# EAGLE design lampe (EAGLE 6.4)
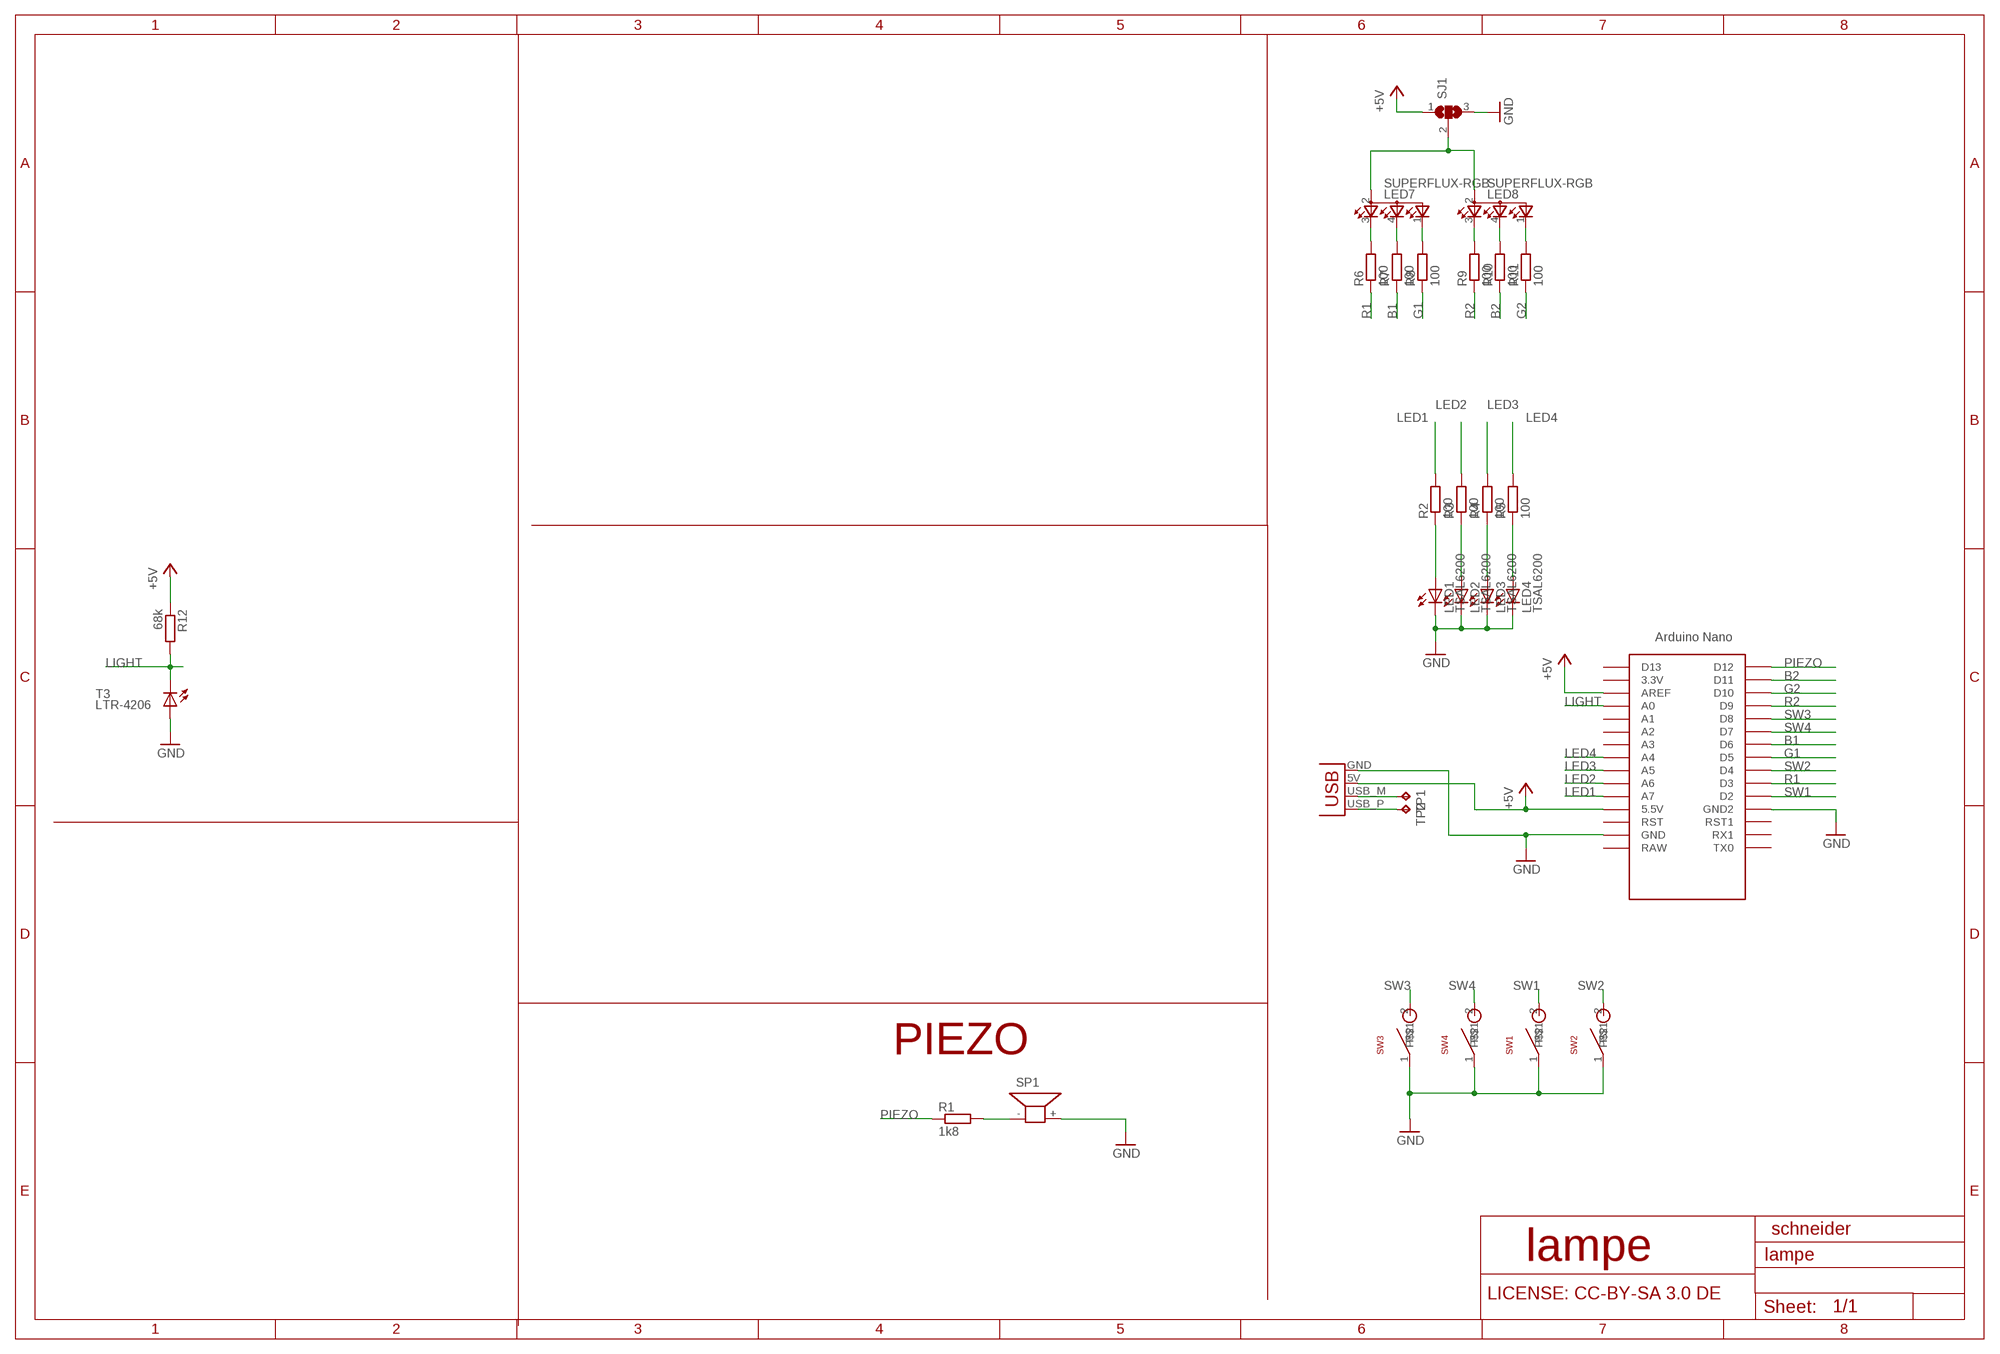
[diagram p0: schematic, sheet 1]

## Parts
LED1  TSAL6200  LED5MM  [LED5MM]
LED2  TSAL6200  LED5MM  [LED5MM]
LED3  TSAL6200  LED5MM  [LED5MM]
LED4  TSAL6200  LED5MM  [LED5MM]
LED7  SUPERFLUX-RGB  [SUPERFLUX-7.6X7.6]
LED8  SUPERFLUX-RGB  [SUPERFLUX-7.6X7.6]
R1  1k8  R-EU_0207/7  [0207/7]
R2  100  R-EU_0207/7  [0207/7]
R3  100  R-EU_0207/7  [0207/7]
R4  100  R-EU_0207/7  [0207/7]
R5  100  R-EU_0207/7  [0207/7]
R6  100  R-EU_0207/7  [0207/7]
R7  100  R-EU_0207/7  [0207/7]
R8  100  R-EU_0207/7  [0207/7]
R9  100  R-EU_0207/7  [0207/7]
R10  100  R-EU_0207/7  [0207/7]
R11  100  R-EU_0207/7  [0207/7]
R12  68k  R-EU_0207/7  [0207/7]
SJ1  SJ2W  [SJ_2]
SP1  AL11P  [AL11P]
SW1  SWITCH  [SWITCH]
SW2  SWITCH  [SWITCH]
SW3  SWITCH  [SWITCH]
SW4  SWITCH  [SWITCH]
T3  LTR-4206  LED3MM  [LED3MM]
TP1  TPB1,27  [B1,27]
TP2  TPB1,27  [B1,27]
U$1  NANO  [NANO]
X1  USBPCB  [USB-A-PCB]

## Nets
+5V: R12.1 SJ1.1 U$1.5V(5.5V) U$1.AREF X1.5V(VBUS)
B1: R7.1 U$1.D6
B2: R10.1 U$1.D11
G1: R8.1 U$1.D5
G2: R11.1 U$1.D10
GND: LED1.K(C) LED2.K(C) LED3.K(C) LED4.K(C) SJ1.3 SP1.+ SW1.1 SW2.1 SW3.1 SW4.1 T3.A U$1.GND U$1.GND1(GND2) X1.GND
LED1: R2.2 U$1.A7
LED2: R3.2 U$1.A6
LED3: R4.2 U$1.A5
LED4: R5.2 U$1.A4
LIGHT: R12.2 T3.K(C) U$1.A0
N$1: LED2.A R3.1
N$2: LED7.3(CRED) R6.2
N$3: LED3.A R4.1
N$4: LED7.4(CBLUE) R7.2
N$5: LED7.1(CGREEN) R8.2
N$6: LED8.3(CRED) R9.2
N$7: LED8.4(CBLUE) R10.2
N$8: LED8.1(CGREEN) R11.2
N$9: LED7.2(A2) LED8.2(A2) SJ1.2
N$10: LED4.A R5.1
N$11: TP1.TP X1.USB_M(D-)
N$12: TP2.TP X1.USB_P(D+)
N$17: LED1.A R2.1
N$29: R1.2 SP1.-
PIEZO: R1.1 U$1.D12
R1: R6.1 U$1.D3
R2: R9.1 U$1.D9
SW1: SW1.2 U$1.D2
SW2: SW2.2 U$1.D4
SW3: SW3.2 U$1.D8
SW4: SW4.2 U$1.D7
Unconnected: U$1.3.3V U$1.A1 U$1.A2 U$1.A3 U$1.D13 U$1.RAW U$1.RST U$1.RST1 U$1.RX1 U$1.TX0

## Notes on the sheet
- PIEZO
- schneider
- lampe
- LICENSE: CC-BY-SA 3.0 DE

## Library data of the parts
LED1-LED4 T3 = led:LED: LED OSRAM: - CHIPLED LG R971, LG N971, LY N971, LG Q971, LY Q971, LO R971, LY R971 LH N974, LH R974 LS Q976, LO Q976, LY Q976 LO Q996 - Hyper CHIPLED LW Q18S LB Q993, LB Q99A, LB R99A - SideLED LS A670, LO A670, LY A670, LG A670, LP A670 LB A673, LV A673, LT A673, LW A673 LH A674 LY A675 LS A676, LA A676, LO A676, LY A676, LW A676 LS A679, LY A679, LG A679 - Hyper Micro SIDELED® LS Y876, LA Y876, LO Y876, LY Y876 LT Y87S - SmartLED LW L88C, LW L88S LB L89C, LB L89S, LG L890 LS L89K, LO L89K, LY L89K LS L896, LA L896, LO L896, LY L896 - TOPLED LS T670, LO T670, LY T670, LG T670, LP T670 LSG T670, LSP T670, LSY T670, LOP T670, LYG T670 LG T671, LOG T671, LSG T671 LB T673, LV T673, LT T673, LW T673 LH T674 LS T676, LA T676, LO T676, LY T676, LB T676, LH T676, LSB T676, LW T676 LB T67C, LV T67C, LT T67C, LS T67K, LO T67K, LY T67K, LW E67C LS E67B, LA E67B, LO E67B, LY E67B, LB E67C, LV E67C, LT E67C LW T67C LS T679, LY T679, LG T679 LS T770, LO T770, LY T770, LG T770, LP T770 LB T773, LV T773, LT T773, LW T773 LH T774 LS E675, LA E675, LY E675, LS T675 LS T776, LA T776, LO T776, LY T776, LB T776 LHGB T686 LT T68C, LB T68C - Hyper Mini TOPLED® LB M676 - Mini TOPLED Santana® LG M470 LS M47K, LO M47K, LY M47K Source: http://www.osram.convergy.de LUXEON: - LUMILED® LXK2-PW12-R00, LXK2-PW12-S00, LXK2-PW14-U00, LXK2-PW14-V00 LXK2-PM12-R00, LXK2-PM12-S00, LXK2-PM14-U00 LXK2-PE12-Q00, LXK2-PE12-R00, LXK2-PE12-S00, LXK2-PE14-T00, LXK2-PE14-U00 LXK2-PB12-K00, LXK2-PB12-L00, LXK2-PB12-M00, LXK2-PB14-N00, LXK2-PB14-P00, LXK2-PB14-Q00 LXK2-PR12-L00, LXK2-PR12-M00, LXK2-PR14-Q00, LXK2-PR14-R00 LXK2-PD12-Q00, LXK2-PD12-R00, LXK2-PD12-S00 LXK2-PH12-R00, LXK2-PH12-S00 LXK2-PL12-P00, LXK2-PL12-Q00, LXK2-PL12-R00 Source: www.luxeon.com KINGBRIGHT: KA-3528ASYC Source: www.kingbright.com
LED7 LED8 = led:SUPERFLUX-RGB
R1-R12 = rcl:R-EU_: RESISTOR, European symbol
SJ1 = jumper:SJ2W: SMD solder JUMPER
SP1 = buzzer:AL11P: SPEAKER Source: Buerklin
SW1-SW4 = badge:SWITCH
TP1 TP2 = testpad:TP: Test pad
U$1 = Arduino-clone:NANO: Arduino Nano
X1 = SparkFun:USB: USB Connectors USB-B-PTH is fully proven SKU : PRT-00139 USB-miniB is fully proven SKU : PRT-00587 USB-A-PCB is untested. USB-A-H is throughly reviewed, but untested. Spark Fun Electronics SKU : PRT-00437 USB-B-SMT is throughly reviewed, but untested. Needs silkscreen touching up. USB-A-S has not been used/tested USB-MB-H has not been used/tested

## Board
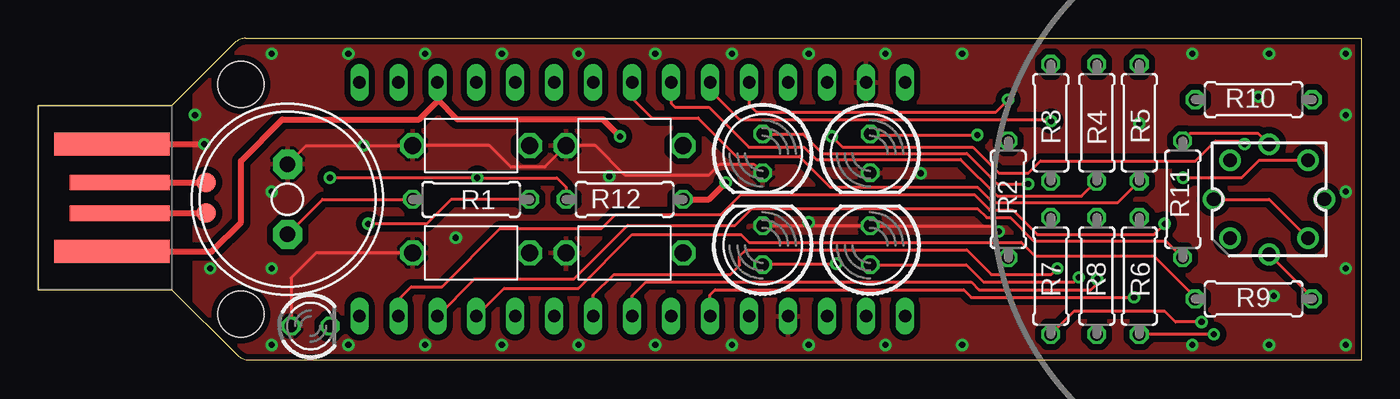
[diagram p1: board, top side]
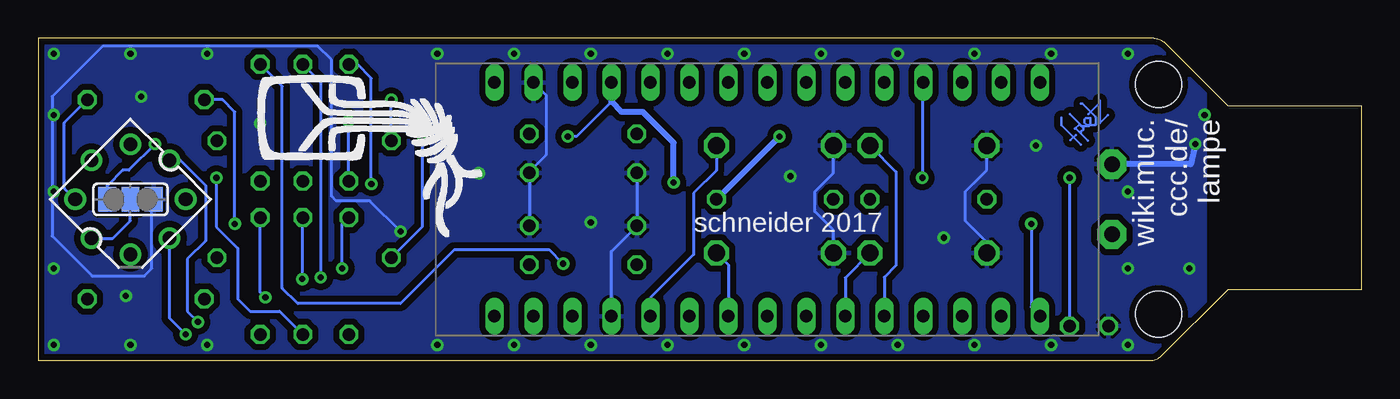
[diagram p2: board, bottom side, seen from below]

Size 86.2 x 21 mm. Coordinates in mm from the lower left corner, seen from the top.
Outline: 86.2,21 86.2,0 13.71,0 arc-45 13.01,0.29 8.7,4.6 0,4.6 0,16.6 8.7,16.6 12.81,20.71 arc-45 13.51,21 86.2,21
Copper layers (1*16): Top 0.018mm / dielectric 1.55mm / Bottom 0.018mm
Design rules "Multi-CB_2L_125um-Tracks_OL35um": minimum track width 0.125mm, minimum drill 0.2mm, track to track 0.125mm, track to pad 0.125mm, pad to pad 0.125mm, via to via 0.125mm, smd to smd 0mil, copper to edge 0.2mm, drill to drill 0.2mm, minimum pad ring 0.125mm, minimum via ring 0.125mm, stop-mask expansion 2mil, vias tented up to drill 0.45mm, thermal gap 0.2mm
Holes 3 mm at 13.2,3 13.2,18

### Footprints (pad centres in the part's own frame; a part is rotated, then mirrored left to right if it is on the bottom)
LED5MM = drill 0.813 octagon: A -1.27,0; K 1.27,0
SUPERFLUX-7.6X7.6 = drill 0.9 pad 1.422: 1 2.54,2.54; 2 2.54,-2.54; 3 -2.54,-2.54; 4 -2.54,2.54
0207/7 = drill 0.813 octagon: 1 -3.81,0; 2 3.81,0
SJ_2 = smd 1.168 x 1.6: 1 -1.524,0; 2 0,0; 3 1.524,0
AL11P = drill 1.016 pad 1.905 octagon: + 2.286,0; - -2.286,0
SWITCH = drill 1.1 octagon: 1 -3.81,0; 2 3.81,0
LED3MM = drill 0.813 octagon: A -1.27,0; K 1.27,0
B1,27 = smd 1.27 x 1.27: TP 0,0
NANO = drill 0.8 long: 3.3V -7.62,15.24; 5V -7.62,-10.16; A0 -7.62,10.16; A1 -7.62,7.62; A2 -7.62,5.08; A3 -7.62,2.54; A4 -7.62,0; A5 -7.62,-2.54; A6 -7.62,-5.08; A7 -7.62,-7.62; AREF -7.62,12.7; D2 7.62,-7.62; D3 7.62,-5.08; D4 7.62,-2.54; D5 7.62,0; D6 7.62,2.54; D7 7.62,5.08; D8 7.62,7.62; D9 7.62,10.16; D10 7.62,12.7; D11 7.62,15.24; D12 7.62,17.78; D13 -7.62,17.78; GND -7.62,-15.24; GND1 7.62,-10.16; RAW -7.62,-17.78; RST -7.62,-12.7; RST1 7.62,-12.7; RX1 7.62,-15.24; TX0 7.62,-17.78
USB-A-PCB = smd 7.5 x 1.5: 5V -0.2,-3.5; GND -0.2,3.5 | smd 6.5 x 1: USB_M 0.3,-1; USB_P 0.3,1

### Placement (x,y rotation side)
LED1  54.2,13.5 270 top
LED2  47.2,13.5 270 top
LED3  54.2,7.5 90 top
LED4  47.2,7.5 90 top
LED7  80.2,10.5 0 top
LED8  80.2,10.5 45 bottom
R1  28.2,10.5 180 top
R2  63.2,10.5 90 top
R3  65.97,15.5 270 top
R4  68.97,15.5 270 top
R5  71.74,15.5 270 top
R6  71.74,5.5 270 top
R7  65.97,5.5 270 top
R8  68.97,5.5 270 top
R9  79.2,4 0 top
R10  79.2,17 0 top
R11  74.57,10.5 90 top
R12  38.2,10.5 180 top
SJ1  80.2,10.5 0 bottom
SP1  16.24,10.5 90 top
SW1  38.2,14 0 top
SW2  38.2,7 0 top
SW3  28.2,14 0 top
SW4  28.2,7 0 top
T3  17.74,2.23 0 top
TP1  10.95,9.6 0 top
TP2  10.95,11.6 0 top
U$1  38.7,10.5 270 bottom
X1  5,10.6 0 top

### Tracks (layer width: path | path; a pad name or v marks a point on that pad's centre or on a via)
+5V  (via drill 0.4 pad 0.8)
  Top 0.2: 36.81,15.69 36.81,15.7 | v51.7,14.6 52.4,13.9 60.9,13.9 62.6,12.2 64.5,12.2 65.3,13 75.4,13 76.7,14.3 78.4,14.3 v78.6,14.1
  Top 0.4: 36.81,15.7 27.3,15.7 26,17 U$1.AREF 26,16.9 24.8,15.7 15.9,15.7 13.2,13 13.2,9 11.3,7.1 X1.5V | R12.1 43.7,10.5 v44.8,11.6 | v37.9,14.6 36.81,15.69
  Bottom 0.2: v37.91,14.6 v37.9,14.6 | 48.86,16.86 51.12,14.6 v51.7,14.6 | v78.6,14.1 80.3,12.4 80.7,12.4 81.72,11.38 SJ1.1
  Bottom 0.4: v44.8,11.6 44.8,14.2 46.8,16.2 48.2,16.2 48.86,16.86 U$1.5V | R12.1 v37.91,14.6
B1  (via drill 0.4 pad 0.8)
  Top 0.2: U$1.D6 36.16,4.26 37.5,5.6 45.1,5.6 45.7,6.2 45.7,6.8 46.1,7.2 60.5,7.2 62.1,5.6 66,5.6 v66.4,6
  Bottom 0.2: v66.4,6 66.4,8.88 R7.1
B2  (via drill 0.4 pad 0.8)
  Top 0.2: U$1.D11 23.46,3.96 24.3,4.8 26.3,4.8 30.1,8.6 36.7,8.6 37.6,9.5 44.5,9.5 45.8,10.8 61,10.8 62,9.8 63.5,9.8 65.1,8.2 72.7,8.2 v73.4,8.9
  Bottom 0.2: v73.4,8.9 73.4,16.2 74.2,17 R10.1
G1  (via drill 0.4 pad 0.8)
  Top 0.2: U$1.D5 38.7,4.2 39.6,5.1 60.8,5.1 61.3,4.6 68.6,4.6 69,5 v69,5.3
  Bottom 0.2: v69,5.3 68.97,5.33 R8.1
G2
  Top 0.2: U$1.D10 28.42,5.3 34.9,5.3 38.4,8.8 45.4,8.8 46.5,9.9 61.2,9.9 61.8,9.3 63.35,9.3 64.85,7.8 73.46,7.8 R11.1
GND  (via drill 0.4 pad 0.8)
  Top 0.2: LED4.K LED3.K 62.23,8.77 v62.6,8.4 | SW4.1 18.1,7 16.47,5.37 T3.A | SP1.+ 17.45,14 SW3.1 29.4,14 30.8,12.6 32.99,12.6 SW1.1 36.3,14 38.2,12.1 43.7,12.1 44.4,12.8 46.63,12.8 LED2.K
  Top 0.4: X1.GND v10.8,14.1
  Bottom 0.2: LED3.K LED1.K 54.2,12.3 | U$1.GND 53.1,17.28 53.1,13.4 54.2,12.3 | U$1.GND1 48.86,7.11 LED4.K LED2.K | SW2.1 34.39,8.49 35.6,9.7 35.6,11 34.39,12.21 SW1.1 | SW4.1 24.39,7.69 25.8,9.1 25.8,11 24.39,12.41 SW3.1 | 54.2,12.3 54.3,12.2 | v62.6,8.4 64.6,10.4 66.8,10.4 67.1,10.7 67.1,19.6 68,20.5 82,20.5 85.3,17.2 85.3,8.1 82.7,5.5 79.3,5.5 78.8,6 78.8,10.7 78.68,10.58 SJ1.3
  Bottom 0.4: v10.8,14.1 11.11,12.79 SP1.+
  other vias: 85.2,1 80.2,1 75.2,1 60.2,1 55.2,1 50.2,1 45.2,1 40.2,1 35.2,1 30.2,1 25.2,1 20.2,1 15.2,1 15.2,6 11.2,6 15.2,11 10.2,16 85.2,16 85.2,6 85.2,11 85.2,20 80.2,20 75.2,20 60.2,20 55.2,20 50.2,20 45.2,20 40.2,20 35.2,20 30.2,20 25.2,20 20.2,20 15.2,20 27.2,8 21.2,14 37.2,12 50.2,9 57.5,12.2 71.75,15.45 79.5,17.2 80.5,4.2
  pour Top (isolate 0.4): 10.2,22 87.2,22 87.2,-1 10.2,-1
  pour Bottom (isolate 0.4): 10.2,22 87.2,22 87.2,-1 10.2,-1
LED1  (via drill 0.4 pad 0.8)
  Top 0.2: U$1.A7 46.32,16.68 46.8,16.2 62.4,16.2 v63.2,17
  Bottom 0.2: R2.2 v63.2,17
LED2  (via drill 0.4 pad 0.8)
  Top 0.2: U$1.A6 43.78,17.62 45.7,15.7 65.9,15.7 v66,15.6
  Bottom 0.2: v66,15.6 66,11.72 R3.2
LED3
  Top 0.2: U$1.A5 41.24,16.76 41.5,16.5 43.7,16.5 46.3,13.9 49.9,13.9 50.7,13.1 60.1,13.1 62.5,10.7 67.98,10.7 R4.2
LED4
  Top 0.2: U$1.A4 38.7,17.1 40,15.8 43,15.8 45.5,13.3 49.6,13.3 51.6,11.3 61.2,11.3 62.2,10.3 70.35,10.3 R5.2
LIGHT  (via drill 0.4 pad 0.8)
  Top 0.2: R12.2 34.4,11.3 33.8,11.9 v28.6,11.9 v19,11.9
  Top 0.4: R12.2
  Bottom 0.2: U$1.A0 28.6,18.06 v28.6,11.9 | v19,11.9 19,2.24 T3.K
N$1  (via drill 0.4 pad 0.8)
  Top 0.2: LED2.A 49.83,14.77 51.1,13.5 60.5,13.5 62.5,11.5 v64.5,11.5
  Bottom 0.2: v64.5,11.5 64.5,18.4 65.41,19.31 R3.1
N$2  (via drill 0.4 pad 0.8)
  Top 0.2: v76.6,1.7 R6.2
  Bottom 0.2: LED7.3 77.66,2.76 v76.6,1.7
N$3  (via drill 0.4 pad 0.8)
  Top 0.2: LED3.A 60.47,6.23 61.6,5.1 67.5,5.1 v67.8,5.4
  Bottom 0.2: R4.1 67.8,18.14 v67.8,5.4
N$4  (via drill 0.4 pad 0.8)
  Top 0.2: v75.8,2.5 74.1,2.5 73.4,3.2 67.48,3.2 R7.2
  Bottom 0.2: LED7.4 76.94,13.04 75.3,11.4 75.3,7.8 76.5,6.6 76.5,3.2 v75.8,2.5
N$5  (via drill 0.4 pad 0.8)
  Top 0.2: LED7.1 79.54,13.04 78.4,11.9 v74.6,11.9
  Bottom 0.2: v74.6,11.9 74.6,8.7 73.2,7.3 73.2,4 72.4,3.2 70.48,3.2 R8.2
N$6
  Top 0.2: R9.2 83.01,4.1 LED8.3
N$7
  Bottom 0.2: LED8.4 84.5,11.21 84.5,15.5 R10.2
N$8
  Top 0.2: LED8.1 79.49,14.8 75.06,14.8 R11.2
N$9
  Top 0.2: LED8.2 SJ1.2 LED7.2
  Bottom 0.2: LED7.2 81.34,7.96 80.2,9.1 SJ1.2
N$10  (via drill 0.4 pad 0.8)
  Top 0.2: LED4.A 47.27,6.3 v52,6.3
  Bottom 0.2: v52,6.3 52.9,7.2 59.1,7.2 62.6,3.7 69.3,3.7 70.3,4.7 70.3,17.87 R5.1
N$11
  Top 0.4: X1.USB_M TP1.TP
N$12
  Top 0.4: X1.USB_P TP2.TP
N$17  (via drill 0.4 pad 0.8)
  Top 0.2: LED1.A 54.27,14.7 v61.2,14.7
  Bottom 0.2: v61.2,14.7 61.2,8.69 R2.1
N$29
  Top 0.2: SP1.- 18.52,10.5 R1.2
N$36
  Bottom 0.15: 18.27,14.08 19.54,15.35 19.54,15.83
N$37
  Bottom 0.15: 18.94,14.35 18.59,14.7
N$38
  Bottom 0.15: 17.81,14.33 18.59,15.1 18.64,15.1 18.36,15.38 18.31,15.38 18.11,15.18 18.11,15.05 18.27,14.9 18.27,14.8
N$39
  Bottom 0.15: 18.96,16.05 18.19,15.28 17.74,15.28 17.64,15.38 17.64,15.8 17.94,15.8 18.04,15.7 18.04,15.5 17.86,15.33 17.34,15.33 17.29,15.38 17.29,15.83
N$40
  Bottom 0.15: 17.31,15.9 18.16,16.75 18.27,16.75
N$41
  Bottom 0.15: 17.02,16.8 17.77,16.05 | 17.02,16.8 17.02,16.93 | 17.02,16.8 17.02,15.48 16.49,16
PIEZO  (via drill 0.4 pad 0.8)
  Top 0.2: R1.1 26.9,10.5 25.3,8.9 v21.5,8.9
  Bottom 0.2: v21.5,8.9 21.5,3.46 U$1.D12
R1  (via drill 0.4 pad 0.8)
  Top 0.2: U$1.D3 43.78,4.28 44.1,4.6 60.3,4.6 60.8,4.1 v71.4,4.1
  Bottom 0.2: v71.4,4.1 71.74,4.44 R6.1
R2
  Top 0.2: U$1.D9 30.36,4.7 35.2,4.7 38.7,8.2 45.8,8.2 46.3,7.7 64.05,7.7 64.95,6.8 72.7,6.8 75.39,4.11 R9.1
SW1
  Bottom 0.2: SW1.2 42.01,12.39 43.5,10.9 43.5,6.9 46.3,4.1 46.3,2.9 U$1.D2
SW2
  Bottom 0.2: SW2.2 41.24,6.23 U$1.D4
SW3
  Bottom 0.2: SW3.2 30.3,12.29 30.3,6.2 31.08,5.42 U$1.D8
SW4
  Bottom 0.2: SW4.2 33.62,5.39 U$1.D7

### Text on the board
bPlace: wiki.muc. / ccc.de/ / lampe | schneider 2017